# Altium schematic sheet 74HC165_SMD.SchDoc
size A4; SheetNumber: 5; SheetTotal: 6
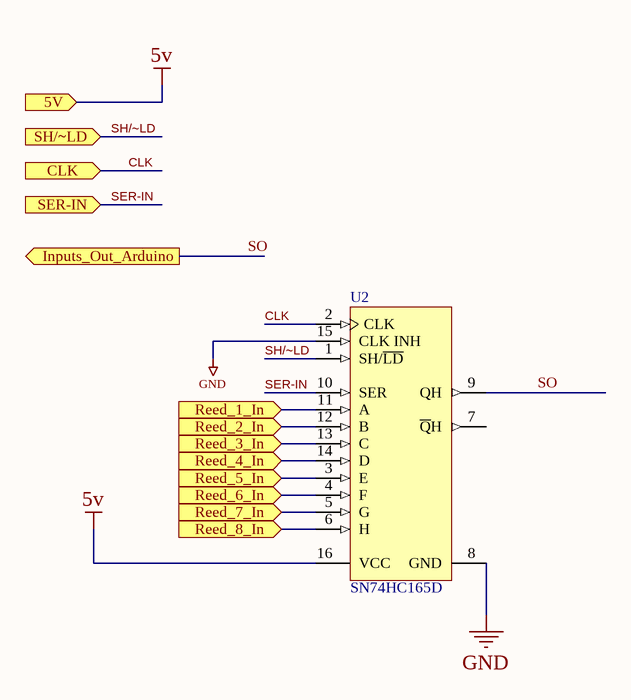
[diagram p0: 74HC165_SMD.SchDoc]

## Parts
U2  SN74HC165D  [D0016A_L]

## Ports
5V (in), CLK (in), Inputs_Out_Arduino (out), Reed_1_In (in), Reed_2_In (in), Reed_3_In (in), Reed_4_In (in), Reed_5_In (in), Reed_6_In (in), Reed_7_In (in), Reed_8_In (in), SER-IN (in), SH/~LD (in)

## Nets
5v: U2.16(VCC) ; port 5V
GND: U2.8(GND) U2.15(CLK_INH)
CLK: U2.2(CLK) ; port CLK
Reed_1_In: U2.11(A) ; port Reed_1_In
Reed_2_In: U2.12(B) ; port Reed_2_In
Reed_3_In: U2.13(C) ; port Reed_3_In
Reed_4_In: U2.14(D) ; port Reed_4_In
Reed_5_In: U2.3(E) ; port Reed_5_In
Reed_6_In: U2.4(F) ; port Reed_6_In
Reed_7_In: U2.5(G) ; port Reed_7_In
Reed_8_In: U2.6(H) ; port Reed_8_In
SER-IN: U2.10(SER) ; port SER-IN
SH/~LD: U2.1(SH/~{LD}) ; port SH/~LD
SO: U2.9(QH) ; port Inputs_Out_Arduino

Not connected (* = marked no-connect by the designer): U2 7(~{Q}H)

## Library data of the parts
U2 = CMP-0780-00021-3: 8-Bit Parallel-Load Shift Registers, D0016A, TUBE; Manufacturer: Texas Instruments; VCC(Min)(V): 2; Technology Family: HC; Input Type: CMOS; Rating: Catalog; ICC @ Nom Voltage(Max)(mA): 0.08; VCC(Max)(V): 6; Bits: 8; Output Drive (IOL/IOH)(Max)(mA): 5.2/-5.2; 3-State Output: No; F @ Nom Voltage(Max)(Mhz): 28; tpd @ Nom Voltage(Max)(ns): 38; PackageReference: D0016A; Operating Temperature Range(C): -40 to 125; Code_JEDEC: MS-012 variation AC; Output Type: CMOS; Voltage(Nom)(V): 6; PackageVersion: http://www.ti.com/lit/ml/mpds178g/mpds178g.pdf; DatasheetVersion: SCLS116G; Generic Part Number: SN74HC165